# EAGLE design snowflake (EAGLE 9.6.2)
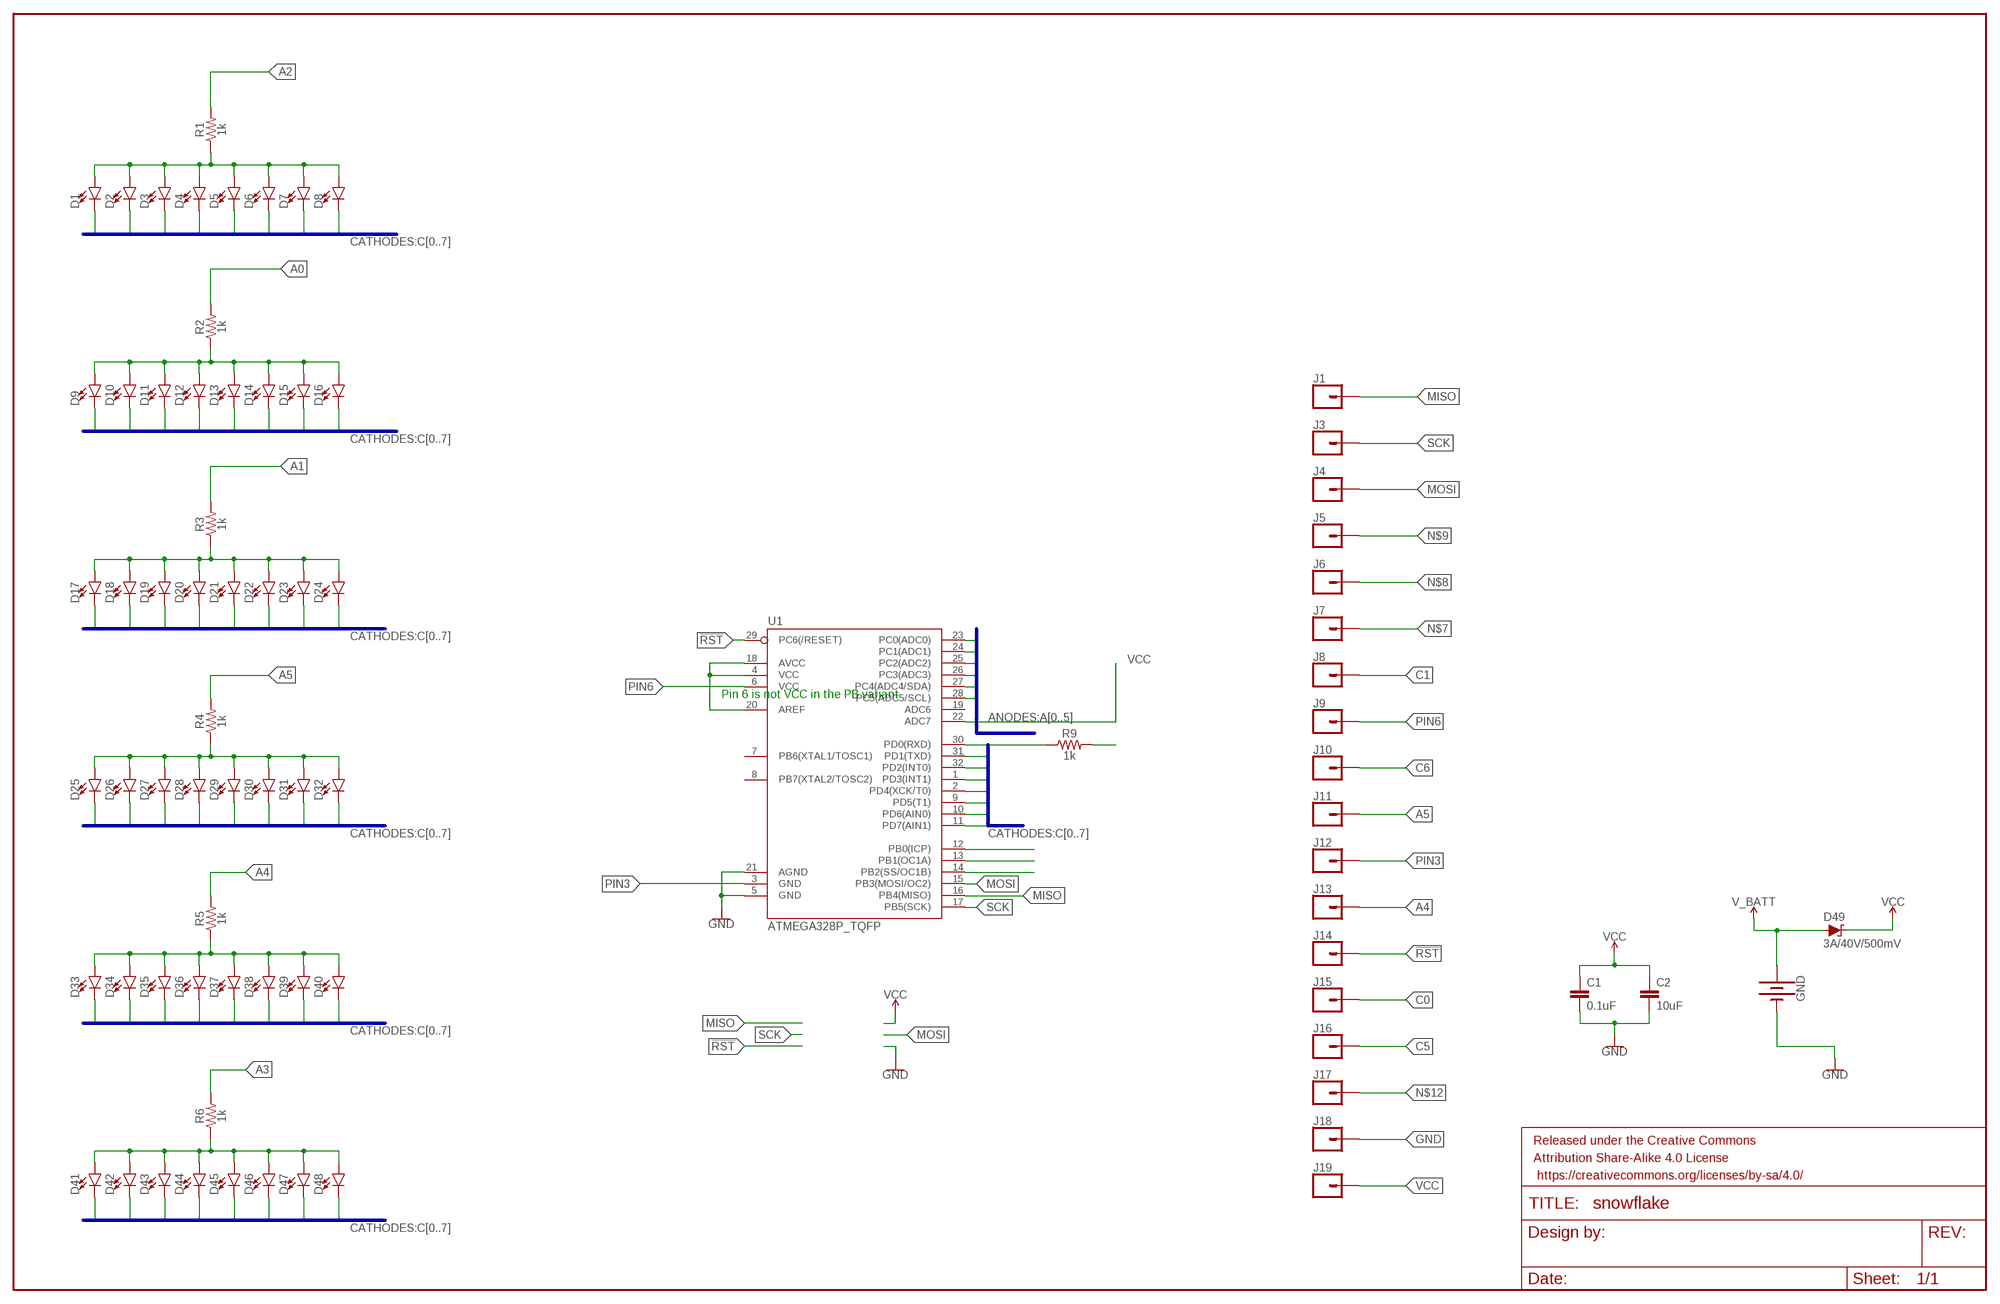
[diagram p0: schematic, sheet 1]

## Parts
C1  0.1uF  0.1UF-0603-25V-5%  [0603]
C2  10uF  10UF-0805-10V-10%  [0805]
D1  LED1206  [LED-1206]
D2  LED1206  [LED-1206]
D3  LED1206  [LED-1206]
D4  LED1206  [LED-1206]
D5  LED1206  [LED-1206]
D6  LED1206  [LED-1206]
D7  LED1206  [LED-1206]
D8  LED1206  [LED-1206]
D9  LED1206  [LED-1206]
D10  LED1206  [LED-1206]
D11  LED1206  [LED-1206]
D12  LED1206  [LED-1206]
D13  LED1206  [LED-1206]
D14  LED1206  [LED-1206]
D15  LED1206  [LED-1206]
D16  LED1206  [LED-1206]
D17  LED1206  [LED-1206]
D18  LED1206  [LED-1206]
D19  LED1206  [LED-1206]
D20  LED1206  [LED-1206]
D21  LED1206  [LED-1206]
D22  LED1206  [LED-1206]
D23  LED1206  [LED-1206]
D24  LED1206  [LED-1206]
D25  LED1206  [LED-1206]
D26  LED1206  [LED-1206]
D27  LED1206  [LED-1206]
D28  LED1206  [LED-1206]
D29  LED1206  [LED-1206]
D30  LED1206  [LED-1206]
D31  LED1206  [LED-1206]
D32  LED1206  [LED-1206]
D33  LED1206  [LED-1206]
D34  LED1206  [LED-1206]
D35  LED1206  [LED-1206]
D36  LED1206  [LED-1206]
D37  LED1206  [LED-1206]
D38  LED1206  [LED-1206]
D39  LED1206  [LED-1206]
D40  LED1206  [LED-1206]
D41  LED1206  [LED-1206]
D42  LED1206  [LED-1206]
D43  LED1206  [LED-1206]
D44  LED1206  [LED-1206]
D45  LED1206  [LED-1206]
D46  LED1206  [LED-1206]
D47  LED1206  [LED-1206]
D48  LED1206  [LED-1206]
D49  3A/40V/500mV  DIODE-SCHOTTKY-B340A  [SMA-DIODE]
FRAME1  FRAME-LEDGER  [CREATIVE_COMMONS]
GND  BATTERY-20MM_SMD  [BATTCON_20MM]
J1  CONN_01  [1X01]
J3  CONN_01  [1X01]
J4  CONN_01  [1X01]
J5  CONN_01  [1X01]
J6  CONN_01  [1X01]
J7  CONN_01  [1X01]
J8  CONN_01  [1X01]
J9  CONN_01  [1X01]
J10  CONN_01  [1X01]
J11  CONN_01  [1X01]
J12  CONN_01  [1X01]
J13  CONN_01  [1X01]
J14  CONN_01  [1X01]
J15  CONN_01  [1X01]
J16  CONN_01  [1X01]
J17  CONN_01  [1X01]
J18  CONN_01  [1X01]
J19  CONN_01  [1X01]
R1  1k  1KOHM-0603-1/10W-1%  [0603]
R2  1k  1KOHM-0603-1/10W-1%  [0603]
R3  1k  1KOHM-0603-1/10W-1%  [0603]
R4  1k  1KOHM-0603-1/10W-1%  [0603]
R5  1k  1KOHM-0603-1/10W-1%  [0603]
R6  1k  1KOHM-0603-1/10W-1%  [0603]
R9  1k  1KOHM-0603-1/10W-1%  [0603]
U1  ATMEGA328P_TQFP  [TQFP32-08]

## Nets
!RST: J14.1 U1.29(PC6(/RESET))
A0: R2.2 U1.23(PC0(ADC0))
A1: R3.2 U1.24(PC1(ADC1))
A2: R1.2 U1.25(PC2(ADC2))
A3: R6.2 U1.26(PC3(ADC3))
A4: J13.1 R5.2 U1.27(PC4(ADC4/SDA))
A5: J11.1 R4.2 U1.28(PC5(ADC5/SCL))
C0: D1.C D9.C D17.C D25.C D33.C D41.C J15.1 R9.1 U1.30(PD0(RXD))
C1: D2.C D10.C D18.C D26.C D34.C D42.C J8.1 U1.31(PD1(TXD))
C2: D3.C D11.C D19.C D27.C D35.C D43.C U1.32(PD2(INT0))
C3: D4.C D12.C D20.C D28.C D36.C D44.C U1.1(PD3(INT1))
C4: D5.C D13.C D21.C D29.C D37.C D45.C U1.2(PD4(XCK/T0))
C5: D6.C D14.C D22.C D30.C D38.C D46.C J16.1 U1.9(PD5(T1))
C6: D7.C D15.C D23.C D31.C D39.C D47.C J10.1 U1.10(PD6(AIN0))
C7: D8.C D16.C D24.C D32.C D40.C D48.C U1.11(PD7(AIN1))
GND: C1.2 C2.2 GND.2(-) J18.1 U1.5(GND) U1.21(AGND)
MISO: J1.1 U1.16(PB4(MISO))
MOSI: J4.1 U1.15(PB3(MOSI/OC2))
N$1: D1.A D2.A D3.A D4.A D5.A D6.A D7.A D8.A R1.1
N$2: D9.A D10.A D11.A D12.A D13.A D14.A D15.A D16.A R2.1
N$3: D17.A D18.A D19.A D20.A D21.A D22.A D23.A D24.A R3.1
N$4: D25.A D26.A D27.A D28.A D29.A D30.A D31.A D32.A R4.1
N$5: D33.A D34.A D35.A D36.A D37.A D38.A D39.A D40.A R5.1
N$6: D41.A D42.A D43.A D44.A D45.A D46.A D47.A D48.A R6.1
N$7: J7.1 U1.12(PB0(ICP))
N$8: J6.1 U1.13(PB1(OC1A))
N$9: J5.1 U1.14(PB2(SS/OC1B))
N$12: J17.1 R9.2
PIN3: J12.1 U1.3(GND)
PIN6: J9.1 U1.6(VCC)
SCK: J3.1 U1.17(PB5(SCK))
V_BATT: D49.A GND.1(+)
VCC: C1.1 C2.1 D49.C J19.1 U1.4(VCC) U1.18(AVCC) U1.20(AREF) U1.22(ADC7)
Unconnected: U1.7(PB6(XTAL1/TOSC1)) U1.8(PB7(XTAL2/TOSC2)) U1.19(ADC6)

## Buses
CATHODES:C[0..7]
ANODES:A[0..5]

## Notes on the sheet
- Pin 6 is not VCC in the PB variant

## Library data of the parts
C1 = SparkFun-Capacitors:0.1UF: 0.1µF ceramic capacitors A capacitor is a passive two-terminal electrical component used to store electrical energy temporarily in an electric field.; PROD_ID: CAP-08604
C2 = SparkFun-Capacitors:10UF: 10.0µF ceramic capacitors A capacitor is a passive two-terminal electrical component used to store electrical energy temporarily in an electric field.; PROD_ID: CAP-11330
D1-D48 = SparkFun-LED:LED: LED (Generic) Standard schematic elements and footprints for 5mm, 3mm, 1206, and 0603 sized LEDs. Generic LEDs with no color specified.
D49 = SparkFun-DiscreteSemi:DIODE-SCHOTTKY: Schottky diode A Schottky diode is a semiconductor diode which has a low forward voltage drop and a very fast switching action.; PROD_ID: DIO-09886
FRAME1 = SparkFun-Aesthetics:FRAME-LEDGER: Schematic Frame - Ledger Standard 11x14 US Ledger frame
GND = SparkFun-Batteries:BATTERY: Battery - Single Cell A variety of battery chemistries, sizes, and footprints. Device List: 20MM_PTH - Coin Cell Battery Holder - 20mm (PTH) 6.8MM_PTH - Coin Cell Battery Holder - 6.8MM(SMD) 12MM_SMD - Coin Cell Battery Holder - 12mm (SMD) 12MM_PTH - Coin Cell Battery Holder - 12mm (PTH) 20MM_SMD - 20mm Coin Cell Battery Holder (SMD) (2 legs) Used on the Big Time Watch Kit 20MM_SMD_4LEGS - Coin Cell Battery Holder - 20mm (SMD) 20MM_SMD_4LEGS_OVERPASTE - Coin Cell Battery Holder - 20mm (SMD) (Over-paste on the legs) 24.5MM_PTH - Coin Cell Battery Holder - 24.5mm (PTH) 9V - 9V Battery Holder - PC Mount Used on the SparkFun SparkPunk Sound Kit and SparkFun SparkPunk Sequencer Kit 18650 - Battery Holder - 18650 (PTH) AA - Battery Holder - 1xAA (PTH) AAA - Battery Holder - 1xAAA (PTH) AA_KIT - Battery Holder - 1xAA (PTH) Special kit package - pads only have exposed copper on one side of the board. AAA_KIT - Battery Holder - 1xAAA (PTH) Special kit package - pads only have exposed copper on one side of the board.; PROD_ID: BATT-11519
J1 J3-J19 = SparkFun-Connectors:CONN_01: Single connection point. Often used as Generic Header-pin footprint for 0.1 inch spaced/style header connections On any of the 0.1 inch spaced packages, you can populate with these: Break Away Headers - Straight (PRT-00116) Break Away Male Headers - Right Angle (PRT-00553) Female Headers (PRT-00115) Break Away Headers - Machine Pin (PRT-00117) Break Away Female Headers - Swiss Machine Pin (PRT-00743) This device is also useful as a general connection point to wire up your design to another part of your project. Our various solder wires solder well into these plated through hole pads. Hook-Up Wire - Assortment (Stranded, 22 AWG) (PRT-11375) Hook-Up Wire - Assortment (Solid Core, 22 AWG) (PRT-11367) View the entire wire category on our website here Special notes: SMTSO-256-ET is a "flush mount" nut for a 4-40 screw. We mostly use this on specialty testbeds; it is a nice way to connect hardware to your PCB at an adjustable hieght. Also note, the SNAP packages are for using a snappable style connector. We sell a baggie of snaps and they are also used on two LilyPad designs: Snap Assortment - 30 pack (male and female) (DEV-11347) LilyPad Arduino SimpleSnap (DEV-10941) LilyPad SimpleSnap Protoboard (DEV-10940)
R1-R6 R9 = SparkFun-Resistors:1KOHM: 1kΩ resistor A resistor is a passive two-terminal electrical component that implements electrical resistance as a circuit element. Resistors act to reduce current flow, and, at the same time, act to lower voltage levels within circuits. - Wikipedia; PROD_ID: RES-07856
U1 = SparkFun-IC-Microcontroller:ATMEGA328P_TQFP: Popular 328P in QFP Storefront component: ATmega328 - TQFP (COM-13448) Datasheet SparkFun Products SparkFun RedBoard - Programmed with Arduino (DEV-12757) Arduino Pro Mini 328 - 5V/16MHz (DEV-11113) Arduino Pro Mini 328 - 3.3V/8MHz (DEV-11114) SparkFun OpenLog (DEV-13712) SparkFun MicroView - OLED Arduino Module (DEV-12923) SparkFun Digital Sandbox (DEV-12651) SparkFun PicoBoard (WIG-11888) Arduino Fio (DEV-10116) LilyPad Arduino 328 Main Board (DEV-13342) SparkFun RedStick (DEV-13741) LilyPad MP3 (DEV-11013) LilyPad Arduino SimpleSnap (DEV-10941) SparkFun Stepoko (ROB-13899) SparkFun Geiger Counter (SEN-11345) SparkFun EL Sequencer (COM-12781) Arduino Pro 328 - 5V/16MHz (DEV-10915) CryptoCape (DEV-12773) SparkFun IR Thermometer Evaluation Board - MLX90614 (SEN-10740) SparkFun RedBot Mainboard (ROB-12097) Arduino Pro 328 - 3.3V/8MHz (DEV-10914) SparkFun Block for Intel® Edison - Arduino (DEV-13036) SparkFun Simon Says - Surface Mount Soldering Kit (KIT-10935) SparkFun 7-Segment Serial Display - Red (COM-11441) SparkFun 7-Segment Serial Display - White (COM-11629) SparkFun 7-Segment Serial Display - Yellow (COM-11443) SparkFun 7-Segment Serial Display - Kelly Green (COM-11440) SparkFun 7-Segment Serial Display - Blue (COM-11442) SparkFun OpenSegment Serial Display - 20mm (Blue) (COM-11647) SparkFun OpenSegment Serial Display - 20mm (Green) (COM-11646) SparkFun OpenSegment Serial Display - 20mm (White) (COM-11648) SparkFun OpenSegment Serial Display - 20mm (Red) (COM-11644) SparkFun OpenSegment Serial Display - 20mm (Yellow) (COM-11645) SparkFun OpenSegment Shield (DEV-13190); PROD_ID: IC-09069

## Module E
Ports: 

### Library data of the parts

## Board
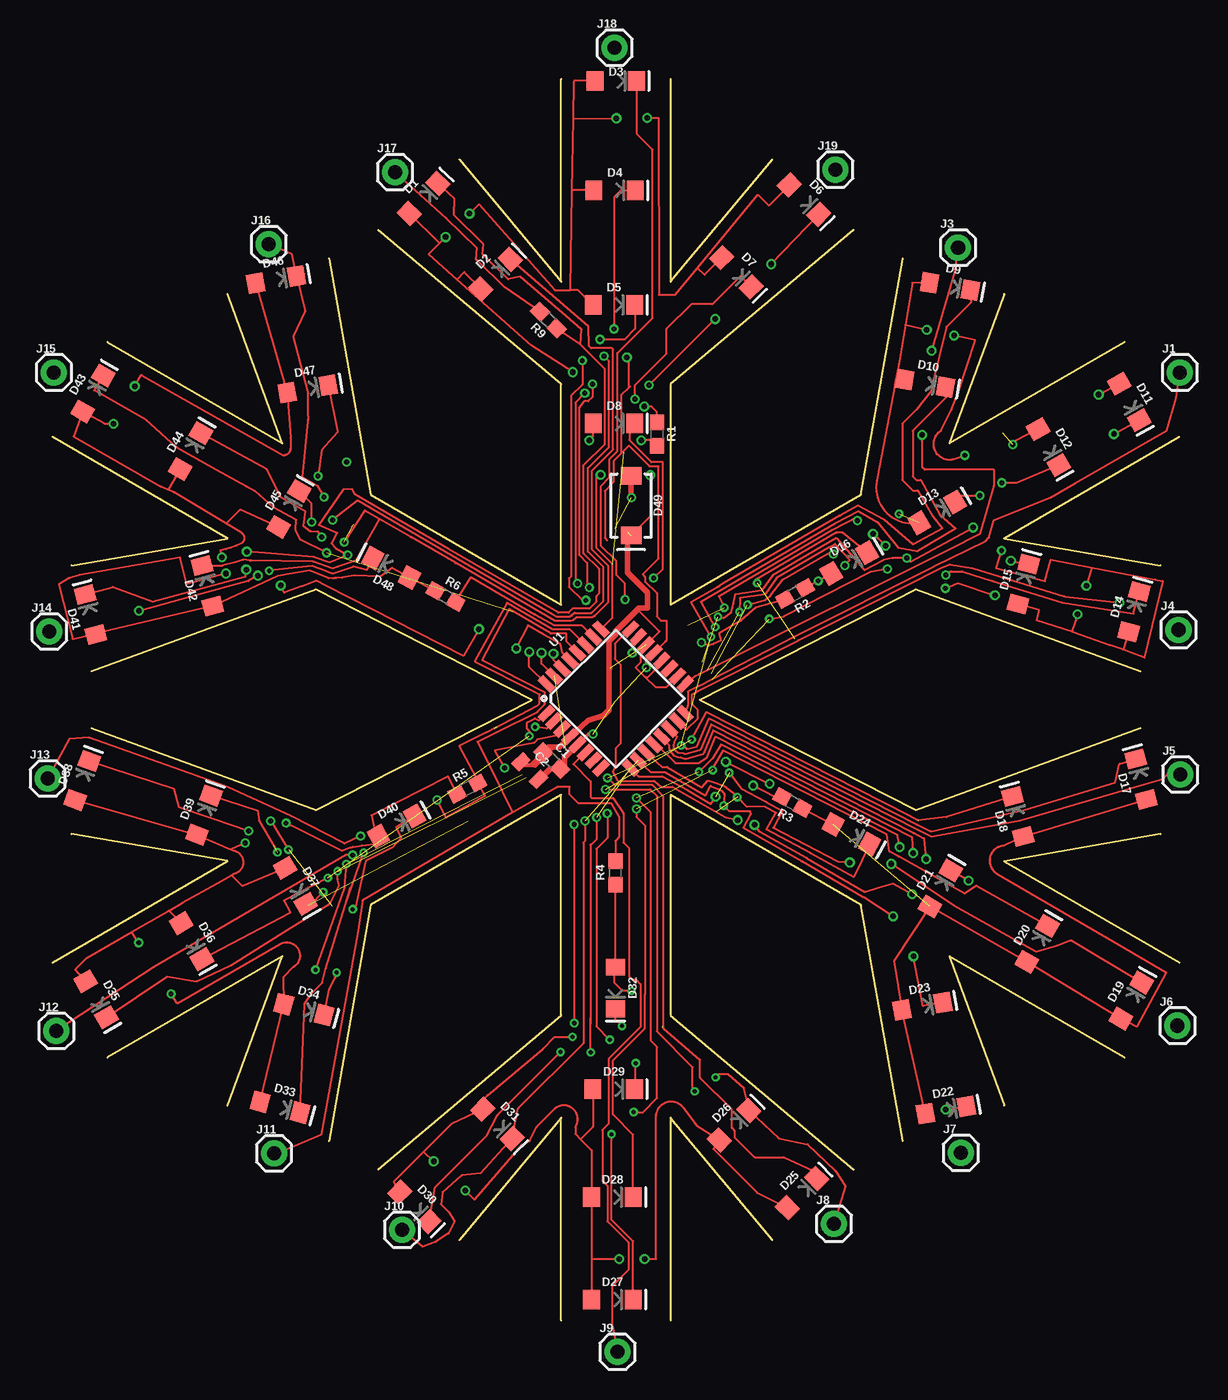
[diagram p1: board, top side]
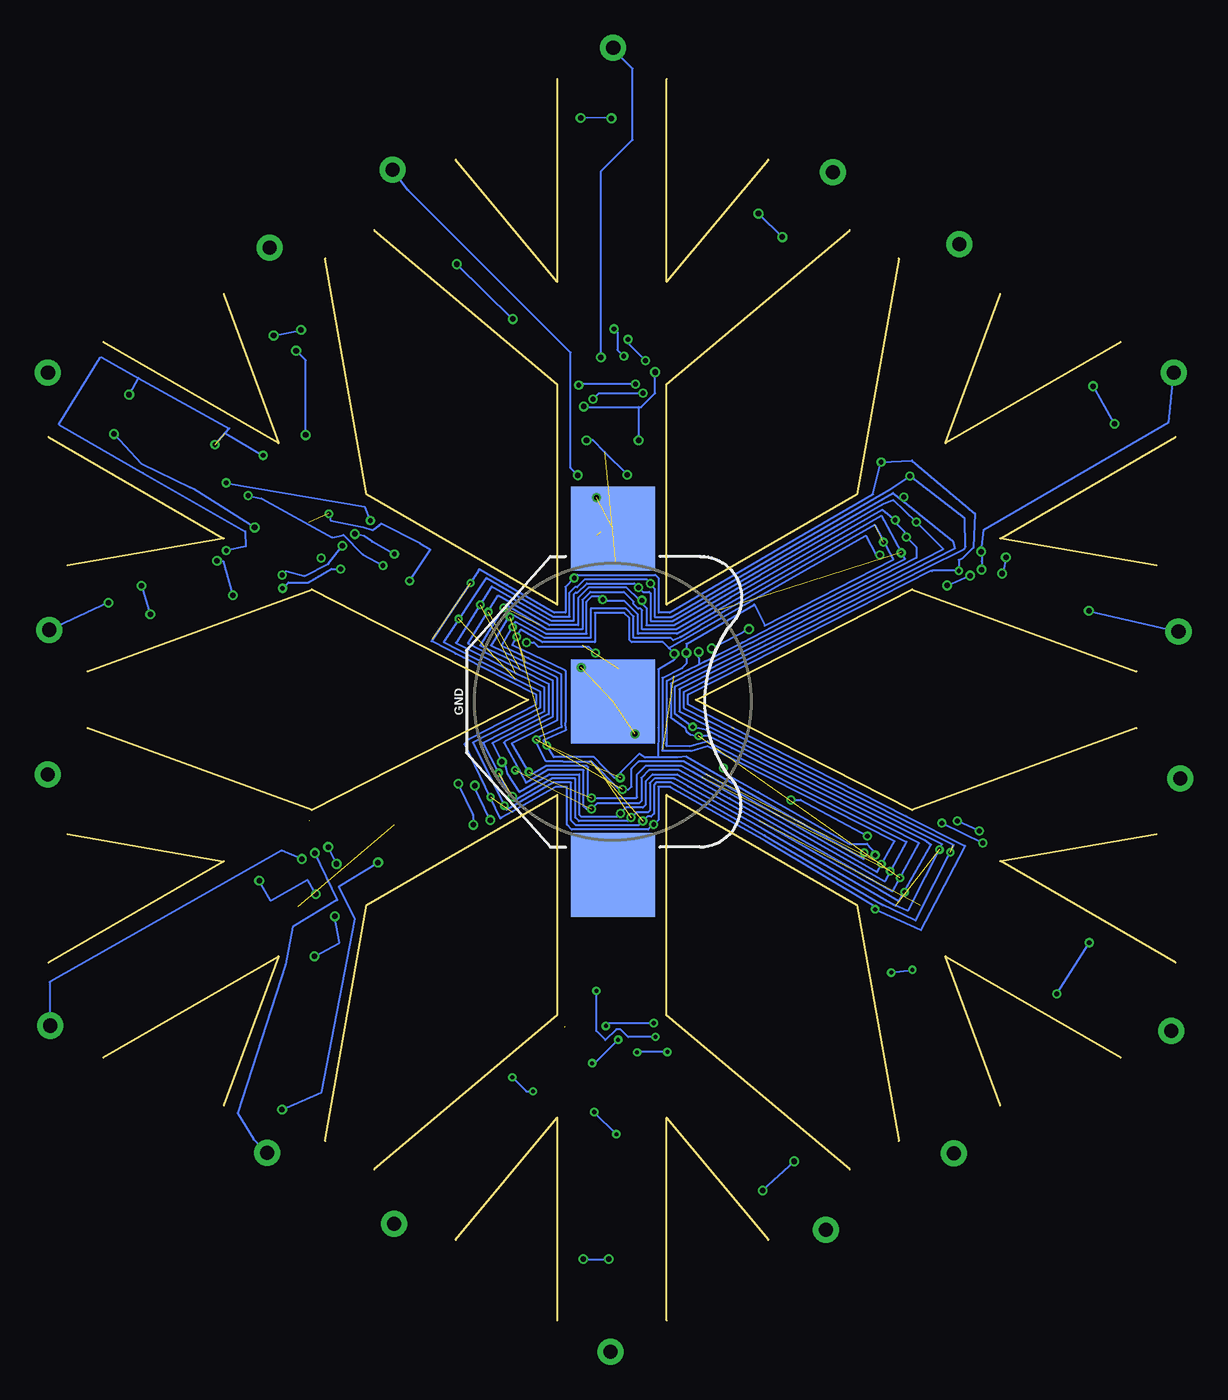
[diagram p2: board, bottom side, seen from below]

Size 81.41 x 89.68 mm. Coordinates in mm from the lower left corner, seen from the top.
Outline: 48 segments
Copper layers (1*16): Top 0.035mm / dielectric 1.5mm / Bottom 0.035mm
Design rules "default *": minimum track width 6mil, minimum drill 0.35mm, track to track 6mil, track to pad 6mil, pad to pad 6mil, via to via 6mil, smd to smd 6mil, copper to edge 0.4mm, drill to drill 6mil, minimum pad ring 10mil, minimum via ring 6mil, stop-mask expansion 4mil, vias tented up to drill 0mil, thermal gap 10mil

### Footprints (pad centres in the part's own frame; a part is rotated, then mirrored left to right if it is on the bottom)
0603 = smd 1.1 x 1: 1 -0.85,0; 2 0.85,0
0805 = smd 0.8 x 1.2: 1 -0.9,0; 2 0.9,0
LED-1206 = smd 1.2 x 1.4: A -1.5,0; C 1.5,0
SMA-DIODE = smd 1.27 x 1.47: A -2.15,0; C 2.15,0
BATTCON_20MM = smd 6.07 x 6.07: 1 -12.5,0; 2 0,0; 3 12.5,0
1X01 = drill 1.016 pad 1.88: 1 0,0
TQFP32-08 = smd 1.27 x 0.559: 1 -4.293,2.8; 2 -4.293,2; 3 -4.293,1.2; 4 -4.293,0.4; 5 -4.293,-0.4; 6 -4.293,-1.2; 7 -4.293,-2; 8 -4.293,-2.8; 17 4.293,-2.8; 18 4.293,-2; 19 4.293,-1.2; 20 4.293,-0.4; 21 4.293,0.4; 22 4.293,1.2; 23 4.293,2; 24 4.293,2.8 | smd 0.559 x 1.27: 9 -2.8,-4.293; 10 -2,-4.293; 11 -1.2,-4.293; 12 -0.4,-4.293; 13 0.4,-4.293; 14 1.2,-4.293; 15 2,-4.293; 16 2.8,-4.293; 25 2.8,4.293; 26 2,4.293; 27 1.2,4.293; 28 0.4,4.293; 29 -0.4,4.293; 30 -1.2,4.293; 31 -2,4.293; 32 -2.8,4.293

### Placement (x,y rotation side)
C1  36.07,40.44 315 top
C2  34.48,39.73 315 top
D1  26.81,81.06 46 top
D2  32.01,75.6 45 top
D3  40.69,89.55 0 top
D4  40.6,81.65 0 top
D5  40.56,73.36 0 top
D6  54.3,80.98 315 top
D7  49.41,75.72 315 top
D8  40.56,64.8 0 top
D9  64.85,74.7 350 top
D10  63.05,67.7 350 top
D11  77.79,66.36 299 top
D12  71.96,63.1 300 top
D13  63.92,58.38 30 top
D14  78.15,51.2 75 top
D15  70.15,53.2 75 top
D16  57.56,54.72 30 top
D17  78.65,39.1 105 top
D18  69.75,36.4 105 top
D19  77.95,23.1 60 top
D20  71.15,27.2 60 top
D21  64.15,31.2 60 top
D22  64.55,15.2 10 top
D23  62.85,22.7 10 top
D24  57.72,35.12 332 top
D25  54.15,9.2 45 top
D26  49.25,14.1 45 top
D27  40.45,1.5 0 top
D28  40.45,8.9 0 top
D29  40.55,16.7 0 top
D30  26.15,8.2 315 top
D31  32.15,14.2 315 top
D32  40.68,24.01 270 top
D33  16.45,15.4 345 top
D34  18.16,22.45 345 top
D35  3.15,23.2 300 top
D36  10.05,27.4 300 top
D37  17.55,31.4 300 top
D38  2.15,39 70 top
D39  10.95,36.5 70 top
D40  24.85,35.71 29 top
D41  2.75,51 105 top
D42  11.19,53.08 105 top
D43  2.92,66.97 60 top
D44  9.97,62.8 60 top
D45  17.07,58.63 60 top
D46  16.15,75.2 10 top
D47  18.45,67.3 10 top
D48  24.47,54.37 152 top
D49  41.81,58.86 270 top
FRAME1  19.15,-26.8 0 top  (outside the outline)
GND  40.65,44.7 270 bottom
J1  81.46,68.49 0 top
J3  65.43,77.51 0 top
J4  81.36,49.9 0 top
J5  81.48,39.43 0 top
J6  81.28,21.3 0 top
J7  65.63,12.1 0 top
J8  56.46,6.97 0 top
J9  40.82,-2.28 0 top
J10  25.25,6.54 0 top
J11  16,12.07 0 top
J12  0.28,20.91 0 top
J13  -0.36,39.15 0 top
J14  -0.23,49.77 0 top
J15  0.1,68.49 0 top
J16  15.62,77.76 0 top
J17  24.74,82.97 0 top
J18  40.61,91.96 0 top
J19  56.57,83.14 0 top
R1  43.67,64.03 270 top
R2  53.64,52.51 210 top
R3  53.45,37.41 151 top
R4  40.67,32.33 90 top
R5  29.98,38.43 28 top
R6  28.4,52.31 330.5 top
R9  35.83,72.27 135 top
U1  40.7,44.92 45 top

### Tracks (layer width: path | path; a pad name or v marks a point on that pad's centre or on a via)
!RST  (via drill 0.4)
  Top 0.152: U1.29 36.86,48.22 36.7,48.88 35.46,49.57 34.35,50.21 v33.5,48.55 | v30.81,49.95 29.69,48.02 19.79,53.07 19.06,53.44 18.03,53.05 16.73,52.57 v16.48,53.1 | v14.83,53.81 14.15,53.4 10.31,52.36 v6.25,51.27
  Bottom 0.152: v33.5,48.55 v30.81,49.95 | v16.48,53.1 v14.83,53.81 | v6.25,51.27 J14.1
A0  (via drill 0.35)
  Top 0.152: U1.23 41.88,48.94 v41.88,48.22 | 46.81,48.98 v46.89,48.98 47.4,48.75 47.73,48.85 48.29,49.13 48.16,49.62 49.76,50.56 50.83,51.52 R2.2
  Bottom 0.152: v46.89,48.98 46.35,48.98 46.06,48.69 42.42,48.68 v41.88,48.22
A1  (via drill 0.4)
  Top 0.152: U1.24 41.67,49.94 40.64,48.9 40.64,47.79 41.05,47.38 41.05,41.69 40.69,41.34 40.69,40.04 40.51,39.63 40.84,38.97 43.48,38.97 43.99,38.54 44.78,38.54 48.59,36.37 v49.5,36.15 | v50.62,38.64 52.21,37.82 R3.2
  Bottom 0.152: v49.5,36.15 50.69,38.64 v50.62,38.64
A2  (via drill 0.4)  (1 unrouted)
  Top 0.152: v39.6,61.1 39.29,61.1 39.29,55.81 40.44,54.67 | 40.44,54.62 40.44,50.73 U1.25 | R1.2 43.27,63.59 v42.54,63.59
  Bottom 0.152: v39.6,61.1 41.24,62.73 42.09,63.59 v42.54,63.59
A3
  Top 0.152: R6.2 30.25,53.71 34.87,51.01 36.22,50.23 38.23,50.23 U1.26
A4  (via drill 0.35)  (1 unrouted)
  Top 0.152: 32.08,42.86 31.32,42.47 29.39,41.49 30.82,38.84 R5.2 31.24,37.88 28.45,36.33 v27.79,37.6 | U1.27 37.39,49.92 36.12,49.92 32.83,51.84 30.5,47.61 34.79,45.43 35.2,45.22 35.2,44.71 35.18,44.59 35.03,44.41 31.9,42.77 | v22.25,34.99 21.1,34.45 17.25,36.43 12.73,38.52 10.46,39.33 2.62,42.1 1.19,42 J13.1
  Bottom 0.152: v27.79,37.6 27.07,37.6 v22.25,34.99
A5
  Top 0.152: U1.28 37.13,49.06 37.13,49.62 36.02,49.62 32.97,51.38 31.04,47.7 35.48,45.43 35.53,45.4 35.53,44.51 35.05,43.98 35,43.93 32.08,42.48 30.71,41.79 31.74,39.72 33.25,36.71 | 33.25,36.71 36.4,38.49 36.47,38.54 37.36,38.54 37.36,37.98 38,37.35 40.39,37.35 40.94,36.41 40.94,34.94 40.67,34.66 R4.2 | 33.25,36.71 22.4,30.34 22.05,27.95 19.41,13.42 15.6,11.77 J11.1
C0  (via drill 0.3, 0.35, 0.4)  (3 unrouted)
  Top 0.152: D9.C 66.35,73.54 64.58,71.78 63.58,67.66 63.5,67.19 62.42,65.81 61.39,64.78 61.39,60.72 62.15,59.95 62.51,59.95 63.61,58.07 64.29,57.21 62.18,56.07 60.09,57.84 58.19,58.89 56.9,58.13 48.44,53.22 48.22,53.1 48.04,52.99 46.14,51.89 v47.57,49.39 | D25.C 55.3,10.68 52.83,11.79 50.73,11.79 49.29,13.23 49.29,13.68 49.07,13.9 49.07,15.25 46.78,17.54 46.78,18.83 44.16,21.11 44.09,21.18 44.08,21.18 | D33.C 18.21,22.87 18.72,23.63 19.48,24.39 19.74,25.41 21.13,29.99 | 21.13,29.99 21.38,30.81 21.51,31.25 | 36.52,47.11 U1.30 36.19,47.72 v36.19,48.17 | 38.14,70.51 39.9,68.74 39.9,63.31 38.38,61.78 38.38,55.41 39.48,54.3 39.48,52.5 39.32,52.33 39.32,51.95 38.79,51.42 37.57,51.42 37.29,51.14 36.55,51.14 28.63,55.74 21.87,59.68 21.63,60.05 21.01,60.03 19.24,57.48 20.57,56.9 20.15,56.13 20.44,55.82 v21.34,55.31 20.02,54.77 18.87,55.15 v14.03,55.54 | 21.13,29.99 v22.48,33.79 | v40.11,39.2 40.64,38.67 43.33,38.67 44.09,37.91 44.09,21.24 | v45.41,41.54 45.5,41.54 45.82,41.28 46.55,41.48 47.42,43.47 47.55,43.44 62.44,35.83 63.47,35.34 70.31,36.91 76.78,38.87 77.09,40.22 D17.C | v14,54.24 13.93,53.73 7.24,51.93 4.37,52.99 D41.C | D1.C 29.01,81.06 28.99,79.91 31.14,77.76 31.08,77.02 32.93,75.23 33.78,75.42 37.09,72.57 38.23,71.59 38.14,70.51 | 38.14,70.51 R9.1
  Bottom 0.152: 36.59,48.56 37.03,49.01 39.29,49.01 39.45,49.16 39.45,50.73 39.83,51.12 41.94,51.12 41.94,49.01 45.75,49.01 47.3,49.9 47.91,48.8 44.07,46.95 44.07,43.19 44.02,42.66 45.64,41.95 44.91,40.7 41.99,40.7 41.27,39.94 40.53,39.2 v40.11,39.2 40.11,39.58 38.73,40.96 38.28,40.68 37.39,40.68 | 36.59,48.56 v36.19,48.17 36.19,47.74 36.27,47.66 37.36,47.03 37.36,42.83 37.39,40.68 | 37.39,40.68 35.94,40.68 35.33,40.73 22.51,33.34 v22.48,33.79 | 36.59,48.56 34.19,49.94 22.37,56.7 21.65,55.33 v21.34,55.31 | v14,54.24 14,54.86 v14.03,55.54 13.84,57.14 0.48,64.91 J15.1
C1  (via drill 0.3, 0.35, 0.4)  (7 unrouted)
  Top 0.152: D10.C 64.55,66.66 62.15,64.27 62.15,60.97 62.41,60.72 62.74,60.72 64.11,58.22 | D34.C 19.99,23.89 20.43,24.77 | 20.43,24.77 20.5,24.9 | 29.15,54.71 36.32,50.53 37.44,50.53 37.59,50.58 37.87,50.79 38.99,50.79 39.17,50.89 40.13,51.85 40.13,54.54 38.99,55.69 38.99,61.4 40.51,62.93 40.51,70.17 40.44,70.24 38.91,70.24 38.77,70.38 38.71,71.82 D2.C | 29.15,54.71 29.08,54.75 | 29.15,54.71 25.9,56.58 23.64,57.89 | 23.64,57.89 22.55,58.52 v21.08,56.22 | 23.64,57.89 21.95,54.91 20.62,54.46 20.25,54.34 18.85,54.82 14.24,54.9 | v19,25.33 21.11,31.25 21.26,32.98 | 20.43,24.77 v20.52,25.13 | v39.95,38.36 43.18,38.36 43.66,37.88 43.66,20.89 46.25,18.3 46.25,16.7 v46.41,16.54 | v47.9,17.56 48.13,17.78 48.78,17.78 49.96,16.77 50.22,15.76 D26.C 52.48,13.14 54.56,12.73 56.57,10.8 57.28,9.69 J8.1 | v47.88,50.1 46.84,51.93 56.57,57.59 58.22,58.46 59.58,57.69 61.11,55.81 62.48,55.56 62.52,55.59 65.25,57.21 64.11,58.22 | U1.31 35.33,47.46 v35.33,48.22 | D42.C 12.27,54.53 13.15,54.77 13.81,54.95 14.24,54.9 | 14.37,54.88 14.24,54.9 | 64.11,58.22 64.19,58.07 | v46.18,41.97 47.24,43.95 47.32,43.93 61.83,36.5 62.49,36.16 62.57,36.12 | D18.C 64.59,36.36 62.54,36.13
  Bottom 0.152: 37.06,41.41 37.06,46.42 35.64,47.13 35.33,47.44 35.33,48.88 30.41,51.72 29.66,50.2 20.39,54.96 21.72,57.48 | 37.06,41.41 37.06,41.23 | 34.16,39.61 35.48,40.37 38.79,40.37 39.29,39.86 39.29,38.57 39.5,38.36 v39.95,38.36 40.18,38.36 42.2,40.38 44.25,40.4 44.6,40.38 45.47,40.39 46.32,42.01 44.35,42.86 44.37,43.14 44.37,46.7 46.76,47.86 48.67,48.77 47.69,50.45 | 34.16,39.61 33.91,39.46 | 21.74,57.47 34.39,50.2 35.76,49.39 36.28,49.15 36.45,49.31 39.14,49.31 39.14,50.86 39.7,51.42 42.24,51.42 42.24,49.31 45.57,49.31 46.1,49.59 47.68,50.46 v47.88,50.1 | 34.16,39.61 21.55,32.4 20.29,34.62 33.81,41.49 35,41.16 37.06,41.16 37.06,41.41 | v20.52,25.13 v19,25.33 | v47.9,17.56 46.89,16.54 v46.41,16.54
  other vias: 21.23,32.98
C2  (via drill 0.3, 0.35, 0.4)  (4 unrouted)
  Top 0.152: U1.32 34.44,47.21 v34.44,48.3 | D3.C 42.19,85.76 43.36,84.59 43.36,72.42 40.82,69.89 40.82,62.8 40.26,62.24 40.26,60.92 39.6,60.26 39.6,55.99 40.74,54.85 40.74,53.86 41.33,53.27 41.33,52.13 v41.38,52.08 | v20.6,32.45 20.6,31.87 20.7,31.42 20.04,30.11 16.94,28.2 12.88,25.66 10.41,24.5 8.28,24.85 D35.C | v42.19,37.75 43.23,36.71 43.23,20.2 43.69,19.75 43.69,16.06 42.67,15.05 v41.99,15.05 | D27.C 41.95,5.72 40.39,7.27 v40.39,13.45 | v48.08,50.84 48.48,50.76 49.05,51.17 49.13,51.5 49.2,51.78 49.33,52.46 51.27,52.77 52.02,53.83 56.63,56.51 58.65,54.23 60.05,54.94 60.69,55.08 v61.72,55.08 62.02,54.83 v66.52,57.29 | 78.87,64.81 D11.C v76.68,64.04 | D43.C 3.01,67.2 6.73,65.08 | 6.73,65.08 6.81,65.03 | 6.73,65.08 8.94,63.1 11.84,61.45 13.98,60.28 | 13.98,60.28 14.1,60.22 | 13.98,60.28 14.63,59.93 15.95,58.76 17.6,57.85 17.55,57.08 17.91,56.4 v19.81,55.46 | v46.71,39.63 47.68,40.61 48.28,41.6 61.05,35.06 v61.21,34.2 | D19.C 73.56,27.44 72.56,27.07 71.09,26.63 65.15,29.96 v60.6,32.98
  Bottom 0.152: 33.27,51.22 36.02,49.62 38.79,49.62 | 34.43,47.39 35.17,47.01 36.75,46.21 36.75,43.29 36.75,41.48 | 34.43,47.39 34.01,47.6 33.91,47.66 33.23,48 | 34.06,47.58 33.23,48 | 33.23,48 33,48.11 31.29,48.98 27.56,50.91 19.53,55.02 21.07,57.81 21.25,58.13 33.27,51.22 | 33.26,51.23 33.27,51.22 | 34.2,39.23 34.87,39.61 | 34.87,39.61 35.69,40.07 38.28,40.07 38.89,39.46 38.89,37.8 38.94,37.75 v42.19,37.75 42.44,37.75 42.44,39.94 42.43,39.95 42.54,40.07 45.49,40.07 46.61,39.42 47.95,41.69 44.68,43.34 44.68,46.44 46.8,47.48 | 46.8,47.48 46.96,47.56 | 38.79,49.62 38.84,49.62 | 46.8,47.48 49.44,48.77 48.04,51.08 45.49,49.62 42.54,49.62 42.54,51.93 42.14,52.33 41.38,52.33 v41.38,52.08 41.27,51.98 39.8,51.98 38.84,51.01 38.84,49.67 38.79,49.62 | 34.87,39.61 20.99,31.73 19.42,34.57 33.79,41.84 35.1,41.48 36.75,41.48 | 36.75,41.51 36.75,41.79 36.75,41.48 | v40.39,13.45 v41.99,15.05 | 71.24,60.2 71.14,60.16 | 71.14,60.16 70.93,60.07 v66.52,57.29 | 71.14,60.16 74.72,61.9 v76.68,64.04 | v34.44,48.3 34.43,47.39 | v60.6,32.98 v61.21,34.2
C3  (via drill 0.3, 0.35)  (3 unrouted)
  Top 0.152: D36.C 17.2,29.47 16.73,30.33 v19.89,31.96 | v39.85,69.66 40.21,69.3 40.21,63.1 38.68,61.58 38.68,55.53 39.8,54.42 39.8,51.98 38.94,51.12 37.72,51.12 37.52,50.91 37.36,50.84 36.45,50.84 36.12,51.01 28.83,55.26 | v40.56,71.64 40.58,71.65 40.58,81.14 41.09,81.65 D4.C | 28.83,55.26 28.75,55.31 | 28.83,55.26 22.04,59.22 20.28,57.85 v20.24,57.82 | v34.44,42.23 34.49,42.48 34.29,42.71 34.29,43.22 34.85,43.5 35.15,43.34 U1.1 | v42.19,36.94 42.19,36.38 42.8,35.77 42.8,23.56 42.8,21.09 40.49,18.78 40.49,14.87 41.95,13.41 D28.C | v48.54,51.5 48.13,52.31 56.36,57.1 58.17,58.02 58.25,57.97 v58.17,57.8 | D12.C 69.64,60.51 v68.58,60.51 | v47.7,39.76 47.76,40.01 48.43,41.17 60.28,35.1 60.48,33.87 61.15,33.51 63.3,32.34 65.91,30.85 66.75,31.4 70.69,29.17 D20.C | D44.C 15.42,61.53 16.48,59.5 18.24,58.48 18.11,57.41 18.62,57.03 19.15,57.01 v19.43,56.6
  Bottom 0.152: 32.21,52.21 36.12,49.92 38.53,49.92 38.53,51.32 38.63,51.42 38.81,51.42 39.14,51.75 39.14,51.93 39.85,52.64 42.27,52.64 42.85,52.05 42.85,49.92 45.39,49.92 45.86,50.21 | 32.21,52.21 32.12,52.26 | 30.69,48.93 36.45,46.01 36.45,43.57 35.43,42.83 35.33,42.55 35.18,42.43 35.03,42.33 v34.44,42.23 33.74,42.22 32.05,41.34 18.53,34.48 20.43,31.01 32.2,37.72 35.87,39.76 38.02,39.76 38.58,39.2 38.58,37.53 38.76,37.35 41.78,37.35 v42.19,36.94 42.54,36.94 42.75,37.15 42.75,39.76 45.39,39.76 46.92,38.86 48.51,41.74 48.4,41.85 44.98,43.6 44.98,46.24 47.17,47.3 50.22,48.78 48.45,51.71 45.86,50.21 | 30.69,48.93 30.46,49.05 | 45.86,50.21 45.92,50.25 | v39.85,69.66 40.31,70.11 40.31,71.38 v40.56,71.64 | 32.21,52.21 32.18,52.23 21.16,58.57 v20.24,57.82 20.24,57.65 19.58,57.01 19.58,56.75 v19.43,56.6 18.69,55.87 18.69,55.1 30.69,48.93 | v68.58,60.51 58.59,58.78 v58.17,57.8
C4  (via drill 0.3, 0.35, 0.4)  (2 unrouted)
  Top 0.152: D5.C 42.09,73.33 42.09,71.64 41.33,70.88 v39.55,70.88 | v38.53,52.03 38.28,52.03 37.31,52.99 37.31,53.6 37.46,53.76 37.46,66.81 38.28,67.62 v38.28,69.35 | v18.72,57.67 18.72,59.03 D45.C | v19.56,30.95 18.57,29.96 18.42,29.98 D37.C | U1.2 35.71,42.76 v34.87,42.89 | v40.08,36.64 40.08,34.86 39.29,34.07 39.29,21.24 v40.26,20.28 | D29.C 42.14,16.79 v42.14,18.58 | v67,59.6 65.68,59.6 D13.C | v57.26,54.55 57.26,54.57 57.61,54.92 56.54,56.1 56.11,55.84 52.3,53.62 51.47,52.46 49.66,52.18 v49.63,51.19 | v48.65,40.35 v51.82,38.77 | v50.72,35.8 51.13,35.29 54.47,33.41 58.7,30.97 59.69,31.28 60.71,31.56 v62.1,30.79 | v66.19,31.76 D21.C
  Bottom 0.152: 30.26,48.79 36.14,45.81 36.14,43.8 v34.87,42.89 33.89,42.65 32.96,42.17 29.91,40.62 29.9,40.6 18.08,34.68 17.65,34.35 19.96,30.3 21.4,31.12 30.09,36.1 | 30.26,48.79 30.1,48.88 | 30.09,36.1 35.99,39.46 37.77,39.46 38.28,38.95 38.28,37.25 38.48,37.04 39.67,37.04 v40.08,36.64 40.33,36.38 42.9,36.38 43.05,36.54 43.05,39.46 45.24,39.46 47.44,38.18 48.29,39.53 48.42,40.12 v48.65,40.35 49.34,41.72 45.29,43.8 45.29,45.98 47.2,46.94 | 30.09,36.1 30.04,36.08 | 47.2,46.94 47.32,47 | 47.2,46.94 49.37,47.98 51.1,48.89 48.92,52.36 45.24,50.23 43.15,50.23 43.15,52.18 42.39,52.94 39.65,52.94 38.73,52.03 v38.53,52.03 38.53,51.78 38.23,51.47 38.23,50.23 36.22,50.23 31.73,52.85 31.37,53.05 30,53.86 21.18,58.94 20.38,59.26 v18.72,57.67 16.76,55.71 30.25,48.79 30.26,48.79 | v38.28,69.35 39.55,70.62 v39.55,70.88 | v42.14,18.58 41.96,18.58 v40.26,20.28 | v67,59.6 66.03,59.38 60.92,56.56 60.1,56.75 58.71,55.35 v57.26,54.55 | v51.82,38.77 50.75,36.51 v50.72,35.8 | v62.1,30.79 62.69,31.81 65.35,30.31 v66.19,31.76
C5  (via drill 0.3, 0.35, 0.4)  (4 unrouted)
  Top 0.152: 18.47,65.34 18.47,66.96 17.38,71.07 18.24,72.93 D46.C 17.3,77.02 J16.1 | 18.47,65.34 18.47,65.03 | v43.1,67.57 v47.88,72.35 | v38.79,52.94 38.63,53.1 38.63,54.72 38.07,55.28 38.07,65.95 38.43,66.4 38.71,66.4 39.01,66.71 v39.01,67.65 | 18.47,65.34 18.04,60.92 19.13,60.31 v19.61,59.5 | v15.75,36.09 15.89,35.95 v17.04,34.02 | v39.32,36.33 39.32,34.76 38.94,34.38 38.86,34.38 38.86,21.83 | 38.86,21.83 38.86,21.42 | D30.C 27.65,9.62 31.34,13.32 32.16,14.84 v36.7,19.39 | v38.89,19.36 38.89,21.8 38.86,21.83 | 50.46,51.7 v50.22,51.7 51.49,52.05 51.87,52.36 52.79,53.53 56.28,55.56 v56.43,55.37 | v64.54,53.86 64.95,54.11 65.73,54.11 67.89,53.44 | U1.9 42.34,39.3 44.07,39.3 45.87,38.31 47.57,37.32 v47.9,37.83 | v59.28,56.82 59.63,56.52 v60.18,55.97 | v48.89,39.56 49.76,38.41 51.56,37.47 52.75,36.81 52.07,35.6 56.77,33.13 v57.61,33.08 | 67.89,53.44 68,53.4 | D14.C 78.1,51.06 72.95,51.85 67.89,53.44 | D6.C v51.92,76.31 | v64.54,15.22 D22.C | D38.C 8.74,38.42 9.12,37.09 13.28,35.67 v14.17,35.37
  Bottom 0.152: 29.16,54.71 36.32,50.53 37.92,50.53 37.92,52.54 38.02,52.64 38.48,52.64 v38.79,52.94 39.09,53.25 42.52,53.25 43.18,52.59 43.33,52.59 43.46,52.46 43.46,50.53 45.08,50.53 49.4,53.02 51.99,48.94 47.16,46.51 | 29.16,54.71 29.1,54.75 | 29.59,48.78 29.67,48.74 | 29.67,48.74 35.84,45.6 35.84,44 28.86,40.44 16.86,34.41 19.33,29.6 20.32,30.01 | 29.75,35.5 35.18,38.57 36.19,39.15 37.64,39.15 37.97,38.82 37.97,36.84 38.1,36.71 38.94,36.71 v39.32,36.33 39.57,36.08 43.1,36.08 43.36,36.33 43.36,39.15 45.08,39.15 47.87,37.54 50.03,41.73 45.59,44 45.59,45.73 47.16,46.51 | 29.75,35.5 29.7,35.47 | 47.62,46.75 47.16,46.51 | v39.01,67.65 43.03,67.65 v43.1,67.57 | 29.16,54.71 20.39,59.78 19.79,59.3 | 29.67,48.74 15.92,55.78 16.08,56.3 19.79,59.3 | 29.75,35.5 20.32,30.01 | 20.32,30.01 20.22,29.96 | v36.7,19.39 38.86,19.39 v38.89,19.36 | v56.43,55.37 58.05,56.26 58.61,56.67 v59.28,56.82 | v19.61,59.5 19.79,59.3 | v64.54,53.86 64.26,54.14 62.92,53.78 61.21,54.65 v60.18,55.97 | v51.92,76.31 v47.88,72.35 | v57.61,33.08 60.45,31.34 59.28,29 61.72,16.44 v64.54,15.22 | v14.17,35.37 v15.75,36.09
C6  (via drill 0.3, 0.35, 0.4)  (3 unrouted)
  Top 0.152: v37.92,53.25 37.77,53.4 37.77,66.3 v38.46,66.99 | v42.09,66.56 42.09,67.57 44.37,69.86 44.37,71.64 46.15,73.42 47.68,73.42 49.71,75.45 49.73,75.4 D7.C | v19.18,61 19.46,62.89 20.6,64.2 D47.C | v16.26,33.82 14.92,36.09 14.81,36.84 D39.C | v38.48,36.08 38.48,34.66 38.35,34.53 38.35,20.02 33.65,15.32 D31.C 30.94,10.63 29.57,10.48 28.17,9.26 28.07,8.39 28.6,7.86 29.06,7.17 28.63,6.28 27.69,5.67 26.75,5.32 J10.1 | 48.75,36.93 48.88,36.8 50.4,36.79 50.48,36.59 49.91,35.6 54.15,33.15 58.52,30.59 58.63,30.57 v60.73,29.19 | 48.75,36.93 | 48.75,36.93 v48.49,37.2 48.54,38 48.36,38.26 48.13,38.39 47.98,38.42 47.55,38.62 47.17,37.93 44.25,39.61 43.21,39.61 U1.10 | v51.79,50.68 52.82,50.84 59.09,54.08 v60.32,54.29 | v64.52,52.89 65.41,53.26 v68.09,52.39 | v69.24,54.87 D15.C | D23.C 62.89,22.72 v62.2,26.3
  Bottom 0.152: 28.85,55.25 36.42,50.84 37.62,50.84 37.62,52.87 37.92,53.17 v37.92,53.25 38.23,53.55 42.65,53.55 43.23,52.97 43.38,52.97 43.76,52.59 43.76,50.84 44.96,50.84 49.82,53.63 52.86,49.01 47.63,46.32 | 28.85,55.25 28.76,55.3 | 29.16,48.65 35.53,45.4 35.53,44.26 28.47,40.63 | 29.16,48.65 29.04,48.7 | 28.47,40.63 28.4,40.59 | 29.68,35.05 36.4,38.85 37.52,38.85 37.67,38.69 37.67,36.61 37.87,36.41 38.15,36.41 v38.48,36.08 38.79,35.77 43.31,35.77 43.66,36.13 43.66,38.85 44.93,38.85 48.32,36.88 50.76,41.74 45.9,44.26 45.9,45.43 47.63,46.32 | 29.68,35.05 29.65,35.04 | 47.63,46.32 47.68,46.34 | v42.09,66.56 41.66,66.99 v38.46,66.99 | 28.85,55.25 20.6,60.06 v19.18,61 15.21,57.95 15.16,55.89 15.26,55.75 18.03,54.34 18.16,54.28 29.16,48.65 | 28.47,40.63 19.41,36.04 16.02,34.34 16.1,34.18 | 29.68,35.05 21.21,30.06 | 21.21,30.06 21.08,29.98 | 16.03,34.33 16.1,34.18 | 16.1,34.18 18.77,28.89 21.21,30.06 | v64.52,52.89 64.08,53.33 62.65,53.33 60.99,54.29 v60.32,54.29 | v68.09,52.39 68.76,54.82 v69.24,54.87 | v62.2,26.3 60.4,27.29 v60.73,29.19
C7  (via drill 0.3, 0.35)  (2 unrouted)
  Top 0.152: v43.43,53.63 44.09,54.29 44.09,62.01 43.27,62.01 41.67,63.61 41.67,64.42 D8.C | D48.C 22.71,54.21 21.74,54.47 20.23,53.97 19.78,54.12 18.77,54.52 v15.65,54.16 | D40.C 24.84,35.62 25.2,34.86 24.59,34.17 22.63,33.18 21.89,29.9 v21.69,29.7 | v37.69,35.82 v37.69,21.47 | v41.15,21.27 40.68,21.74 D32.C | D16.C 57.07,56.93 56.64,56.91 50.79,53.48 v50.93,53.27 | D24.C 57.89,32.04 54.75,33.76 51.59,35.47 52.29,36.68 51.5,37.1 50.16,37.13 v49.48,37.8 49.36,38.02 48.54,38.6 47.73,38.9 47.37,39 46.91,38.52 44.4,39.99 44.02,39.99 U1.11
  Bottom 0.152: 47.89,36.76 44.78,38.54 43.97,38.54 43.97,35.82 43.61,35.47 38.1,35.47 37.74,35.82 v37.69,35.82 37.36,36.15 37.36,38.54 36.5,38.54 29.6,34.63 21.68,29.91 v21.69,29.7 21.67,29.68 18.79,28.39 18.38,28.21 15.33,34.02 15.2,34.29 19.49,36.44 | 47.89,36.76 47.93,36.74 | 51.41,47.88 48.18,46.24 46.2,45.22 46.2,44.51 51.01,41.99 51.36,41.64 48.79,36.27 48.69,36.33 47.89,36.76 | 51.41,47.88 51.48,47.92 52.01,48.18 | 27.84,40.7 33.4,43.55 35.2,44.51 35.2,45.22 28.68,48.54 17.63,54.16 17.58,54.14 17.55,54.16 v15.65,54.16 15.65,54.94 15.35,55.06 14.58,55.84 14.48,58.3 19.02,62.14 v21.26,62.01 21.84,59.7 28.63,55.75 36.54,51.14 37.31,51.14 37.31,53.6 37.57,53.86 43.21,53.86 v43.43,53.63 44.07,52.99 44.07,51.14 44.86,51.14 48.28,53.13 50.28,54.28 50.34,54.19 52.62,50.76 | 27.93,40.75 19.49,36.44 | 19.39,36.38 19.49,36.44 | v37.69,21.47 40.94,21.47 v41.15,21.27 | 52.62,50.76 53.65,49.22 | 51.41,47.88 53.75,49.08 52.62,50.76
GND  (via drill 0.35, 0.4)  (2 unrouted)
  Top 0.152: C1.2 36.95,39.84 | 44.27,49.06 44.37,49.16 44.37,50.56 43.95,50.56 43.66,50.85 43.66,52.54 42.82,53.38 42.82,53.74 42.65,53.91 43.79,55.05 43.79,57.74 43.79,57.92 43.79,61.71 43.13,61.71 41.64,63.19 41.12,62.67 | 44.27,49.06 43.55,48.34 | 44.29,49.06 44.27,49.06 | 40.08,56.35 39.9,56.53 39.9,59.93 40.56,60.59 40.56,62.11 41.12,62.67 | 41.12,62.67 41.12,66.89 41.64,67.41 | 41.64,67.41 41.73,67.5 | 41.64,67.41 41.64,69.44 v41.5,69.58
  Top 0.203: 43.55,48.34 U1.21
  Top 0.254: U1.21 43.42,48.21 42.93,47.71 v42.93,47.18 | U1.5 38.72,42.38 v39.04,42.38
  Top 0.305: U1.5 37.97,41.6 | 37.01,40.18 C1.2
  Top 0.406: U1.5 37.01,40.67 37.01,40.18 | C1.2 35.96,39.84 35.37,39.25 35.28,39.25 C2.2
  Bottom 0.152: v41.5,69.58 41.5,83.02 39.22,85.3 39.22,90.43 40.61,91.83 J18.1
MISO
  Top 0.152: 46.58,45.78 46.7,45.84 | 46.7,45.84 53.67,49.44 63.69,54.48 67.39,56.27 67.66,56.56 68,57.82 72.1,59.45 73.89,60.49 80.49,64.27 81.19,66.69 | 81.19,66.69 81.23,66.81 | 81.19,66.69 J1.1 | 46.7,45.84 45.9,45.43 45.9,44.46 U1.16
MOSI  (via drill 0.4)
  Top 0.152: U1.15 45.76,42.68 45.82,42.68 46.63,43.5 46.63,44.1 46.2,44.54 46.2,45.22 46.65,45.46 53.88,49.14 64.22,54.37 64.88,54.59 66.45,54.34 73.13,52.31 v77.09,51.85
  Bottom 0.152: v77.09,51.85 J4.1
N$1  (via drill 0.4)
  Top 0.152: R1.1 43.67,65.64 43.28,66.03 v42.75,66.03 | v37.59,68.51 34.59,70.44 29.21,75.21 | 29.21,75.21 27.17,77.02 27.98,77.84 | 37.41,74.43 37.54,81.62 | 37.54,81.62 37.63,86.83 | 37.63,86.83 37.68,89.54 37.68,89.55 D3.A | 46.61,76.04 45.01,74.1 43.81,74.1 43.78,86.88 v42.98,86.88 | 46.61,76.04 50.98,81.33 51.76,80.55 D6.A | 37.41,74.43 36.3,74.43 30.8,80.64 v30.12,79.97 | v38.79,63.59 39.06,63.86 D8.A | D2.A 29.74,75.74 29.21,75.21 | D5.A 37.98,74.43 37.41,74.43 | D4.A 37.57,81.65 37.54,81.62 | D7.A 47.11,75.54 46.61,76.04 | 27.98,77.84 v28.4,78.27 | 37.63,86.83 v40.74,86.85 | D1.A 27.98,77.84
  Bottom 0.152: v42.75,66.03 42.72,66 38.79,66 38.79,65.97 | 38.79,65.97 38.61,65.97 37.59,66.99 v37.59,68.51 | 38.79,65.97 v38.79,63.59 | v28.4,78.27 v30.12,79.97 | v40.74,86.85 v42.98,86.88
N$2  (via drill 0.3, 0.35, 0.4)  (2 unrouted)
  Top 0.152: 73.74,49.74 73.66,49.78 v74.07,51.01 | 73.74,49.74 76.38,48.78 77.35,48.45 | 77.35,48.45 77.9,48.27 78.89,47.89 80.21,53.43 79.65,53.53 75.08,54.39 | 75.08,54.39 72.12,54.95 71.7,53.4 68.17,54.34 v68.57,55.62 | v65.91,62.5 65.2,62.24 arc-167 64.19,64.27 64.95,65.8 65.46,67.07 66.66,70.82 v65.15,71.16 | 61.61,71.91 62.11,74.95 D9.A | 61.61,71.91 61.14,69.1 60.88,67.72 | 60.88,67.72 60.85,67.58 59.6,60.91 arc116 D13.A | D12.A 69.61,63.57 v69.39,63.28 | D16.A v55.32,53.43 R2.1 | D10.A 60.9,67.7 60.88,67.72 | v63.17,71.56 61.61,71.91 | 75.08,54.39 v74.7,53.07 | D14.A 77.35,48.45 | 73.74,49.74 71.12,50.58 71.3,51.32 D15.A | v75.59,66.89 D11.A
  Bottom 0.152: v61.16,58.28 61.02,57.79 58.67,57.31 57.99,57.11 57.5,57.48 57.38,57.57 54.6,56.17 53.82,55.69 v55.32,53.43 | 74.93,68.09 77.62,69.58 77.69,69.55 80.67,64.73 74.55,61.2 | 74.93,68.09 68.35,64.45 v69.39,63.28 | 68.66,64.1 v65.91,62.49 v65.91,62.5 | 74.62,61.24 74.55,61.2 | 74.55,61.2 67.21,57.01 67.16,55.92 v68.57,55.62 | v65.15,71.16 v63.17,71.56 | v74.7,53.07 v74.07,51.01 | 74.93,68.09 v75.59,66.89
N$3  (1 unrouted)
  Top 0.152: R3.1 D24.A | D17.A D18.A 68.76,34.3 arc148 68.25,32.27 77.08,27.12 80.47,25.16 78.33,21.22 D19.A D20.A D21.A 60.81,25.97 D23.A D22.A
N$4  (via drill 0.3, 0.4)
  Top 0.152: D30.A 24.65,10 26.81,12.16 | 26.81,12.16 28.85,14.2 D31.A 30.65,15.49 31.42,16.27 35.43,19.63 36.28,20.48 v37.57,20.48 | 38.15,13.09 37.77,13.47 37.77,13.98 arc170 36.25,15.25 34.98,13.98 34.47,12.96 33.96,12.71 30.51,8.72 v29.82,9.38 | 38.15,13.09 38.95,12.3 D28.A 38.95,4.43 | 38.95,4.43 D27.A | D25.A 50.93,9.2 47.75,12.39 D26.A 46.54,14.1 46.41,14.23 45.64,15.25 arc152 43.61,14.74 43.61,4.43 v42.77,4.43 | D29.A 39.05,13.99 38.15,13.09 | v41.83,23.81 41.17,23.81 40.59,24.39 40.59,25.42 D32.A R4.1 | v40.94,4.43 38.95,4.43 | 26.81,12.16 v27.53,11.49
  Bottom 0.152: v37.57,20.48 39.55,20.48 40.11,21.04 40.39,21.04 41.17,20.25 41.83,20.91 v41.83,23.81 | v42.77,4.43 v40.94,4.43 | v27.53,11.49 v29.82,9.38
N$5  (via drill 0.35)
  Top 0.152: 12.94,32.16 13.13,32.27 arc155 13.08,33.94 12.86,34.04 | 12.94,32.16 11.84,31.54 9.37,30.15 8.39,29.59 | D36.A 8.55,29.46 8.39,29.59 | D35.A 1.65,25.35 2.46,26.17 5.73,28.05 | 5.73,28.05 8.39,29.59 | 12.94,32.16 13.7,31.4 D37.A | D40.A 23.38,34.88 | R5.1 28.57,39.3 23.04,36.48 23.38,34.88 | 23.38,34.88 23.47,34.44 22.35,34.33 21.7,34.22 21.54,34.16 20.94,33.93 v16.87,35.93 | D38.A D39.A 12.86,34.04 | v13.92,34.5 12.86,34.04 | D33.A D34.A 16.66,24.79 17.39,25.52 arc180 16.43,27.19 9.01,22.91 v8.56,23.58 | v6.22,27.29 5.73,28.05
  Bottom 0.152: v16.87,35.93 v13.92,34.5 | v8.56,23.58 v6.22,27.29
N$6  (via drill 0.4)
  Top 0.152: 12.56,57.56 13.64,56.91 arc-126 13.64,56.14 arc-17 12.12,55.64 v12.24,55.13 | 12.56,57.56 8.75,59.84 8.34,60.02 | 8.34,60.02 7.82,60.25 1.52,63.87 D43.A 3.76,64.78 v4.39,64.78 | D44.A 8.35,60.02 8.34,60.02 | D46.A D47.A 17.2,63.76 17.2,63 arc-90 16.69,62.49 6.41,68.3 v5.94,67.5 | D45.A 13.57,58.57 12.56,57.56 | R6.1 D48.A 24.54,54.37 23.7,53.76 21.79,53.83 20.93,53.67 20.47,53.63 20.34,53.62 20.27,53.62 19.94,53.63 18.59,54.19 16.28,53.78 11.74,51.67 D42.A 3.45,49.71 | D41.A 3.25,49.67 3.45,49.71 | v12.52,53.96 9.7,53.2 9.22,55.13 1.96,53.86 1.22,53.63 0.46,53.17 1.45,49.23 3.45,49.71
  Bottom 0.152: v4.39,64.78 v5.94,67.5 | v12.24,55.13 12.45,54.09 v12.52,53.96
N$7  (via drill 0.4)
  Top 0.152: U1.12 43.65,41.6 45.01,40.27 46.68,40.27 47.29,40.68 47.9,42.17 62.08,34.94 v62.18,33.77
  Bottom 0.152: 62.1,33.69 v62.18,33.77 60.55,30.36 63.77,28.41 64.29,25.71 67.77,14.97 66.6,13.07 J7.1
N$8  (via drill 0.4)
  Top 0.152: U1.13 44.55,41.56 44.55,41.34 44.68,41.06 44.88,40.83 45.19,40.7 45.39,40.68 45.72,40.57 46.86,40.88 47.02,40.93 47.12,41.06 47.75,42.63 62.17,35.25 | 62.17,35.25 62.28,35.19 | 62.17,35.25 62.97,34.83 v63.12,33.34
  Bottom 0.152: v63.12,33.34 64.57,33.94 81.33,24.45 81.33,21.35 J6.1
N$9
  Top 0.152: U1.14 45.14,42.17 44.91,41.74 44.86,41.54 44.88,41.36 45.01,41.16 45.19,41.03 45.57,40.98 45.69,40.93 46.74,41.21 46.84,41.23 47.6,43.06 62.56,35.42 63.5,34.96 69.9,36.1 78.94,38.75 80.21,39.1 80.54,39.43 J5.1
N$12
  Top 0.152: R9.2 32.66,74.66 30.73,76.52 30.61,76.64 30.66,77.45 28.45,79.64 J17.1
PIN3  (via drill 0.35)
  Top 0.152: U1.3 36.3,42.22 35.03,41.97 34.78,41.72 31.95,41.16 32.68,39.93 v32.66,39.91 | v21.69,33.61 21.2,33.61 7.34,25.52 J12.1
  Bottom 0.152: v32.66,39.91 32.28,39.38 30.15,38.19 23.55,34.43 22.28,34.43 21.69,33.77 v21.69,33.61
PIN6
  Top 0.152: U1.6 37.64,40.19 38.89,38.95 38.89,37.8 38.94,37.75 40.49,37.75 41.25,36.61 41.25,34.53 41.66,34.12 41.66,24.85 41.88,24.62 42.16,24.62 42.49,24.29 42.49,21.22 40.18,18.91 40.18,14.21 39.73,13.75 39.73,10.09 40.08,9.74 40.08,7.15 41.6,5.62 41.6,3.64 40.44,2.47 40.44,-0.37 40.46,-0.4 J9.1
SCK  (via drill 0.4)
  Top 0.152: U1.17 46.41,46.54 46.73,46.71 65.93,56.28 67,56.82 68.01,60.31 68.02,61.45 63.02,61.45 62.84,61.63 v62.84,63.97 | v63.53,70.06 65.23,75.84 | 65.23,75.84 65.28,76.01 | 65.23,75.84 J3.1
  Bottom 0.152: v62.84,63.97 62.84,69.38 v63.53,70.06
V_BATT  (via drill 0.35)  (1 unrouted)
  Top 0.406: D49.A 41.81,59.47 v41.83,59.45
VCC  (via drill 0.4)  (2 unrouted)
  Top 0.152: 42.21,51.39 43.81,49.79 43.87,49.79 U1.22 42.49,48.42 42.49,47.53 42.14,47.18 42.82,46.49 | 42.82,46.49 43.03,46.49 44.01,47.48 U1.20 | U1.18 44.33,45.73 43.59,45.73 42.82,46.49 | v43.18,61.07 43.18,58.09 D49.C
  Top 0.305: 35.84,41.41 C1.1 34.57,40.14 | C2.1 34.06,40.14 34.57,40.14 | 34.57,40.14 34.87,40.14
  Top 0.406: 36.14,41.41 36.62,41.41 U1.4 38.68,43.34 39.8,43.7 40.21,44.1 40.21,47.13 | 36.14,41.41 35.84,41.41 | 36.14,41.41 34.87,40.14 | 41.53,56.96 41.53,54.04 42.98,52.59 42.98,51.47 42.37,51.47 40.67,49.77 40.67,49.54 40.21,49.08 40.21,47.13 | 40.21,47.13 40.23,47.1
  Bottom 0.152: v43.18,61.07 43.69,61.58 43.69,69.94 55.42,81.67 | 55.45,81.67 55.42,81.67 | 55.42,81.67 J19.1